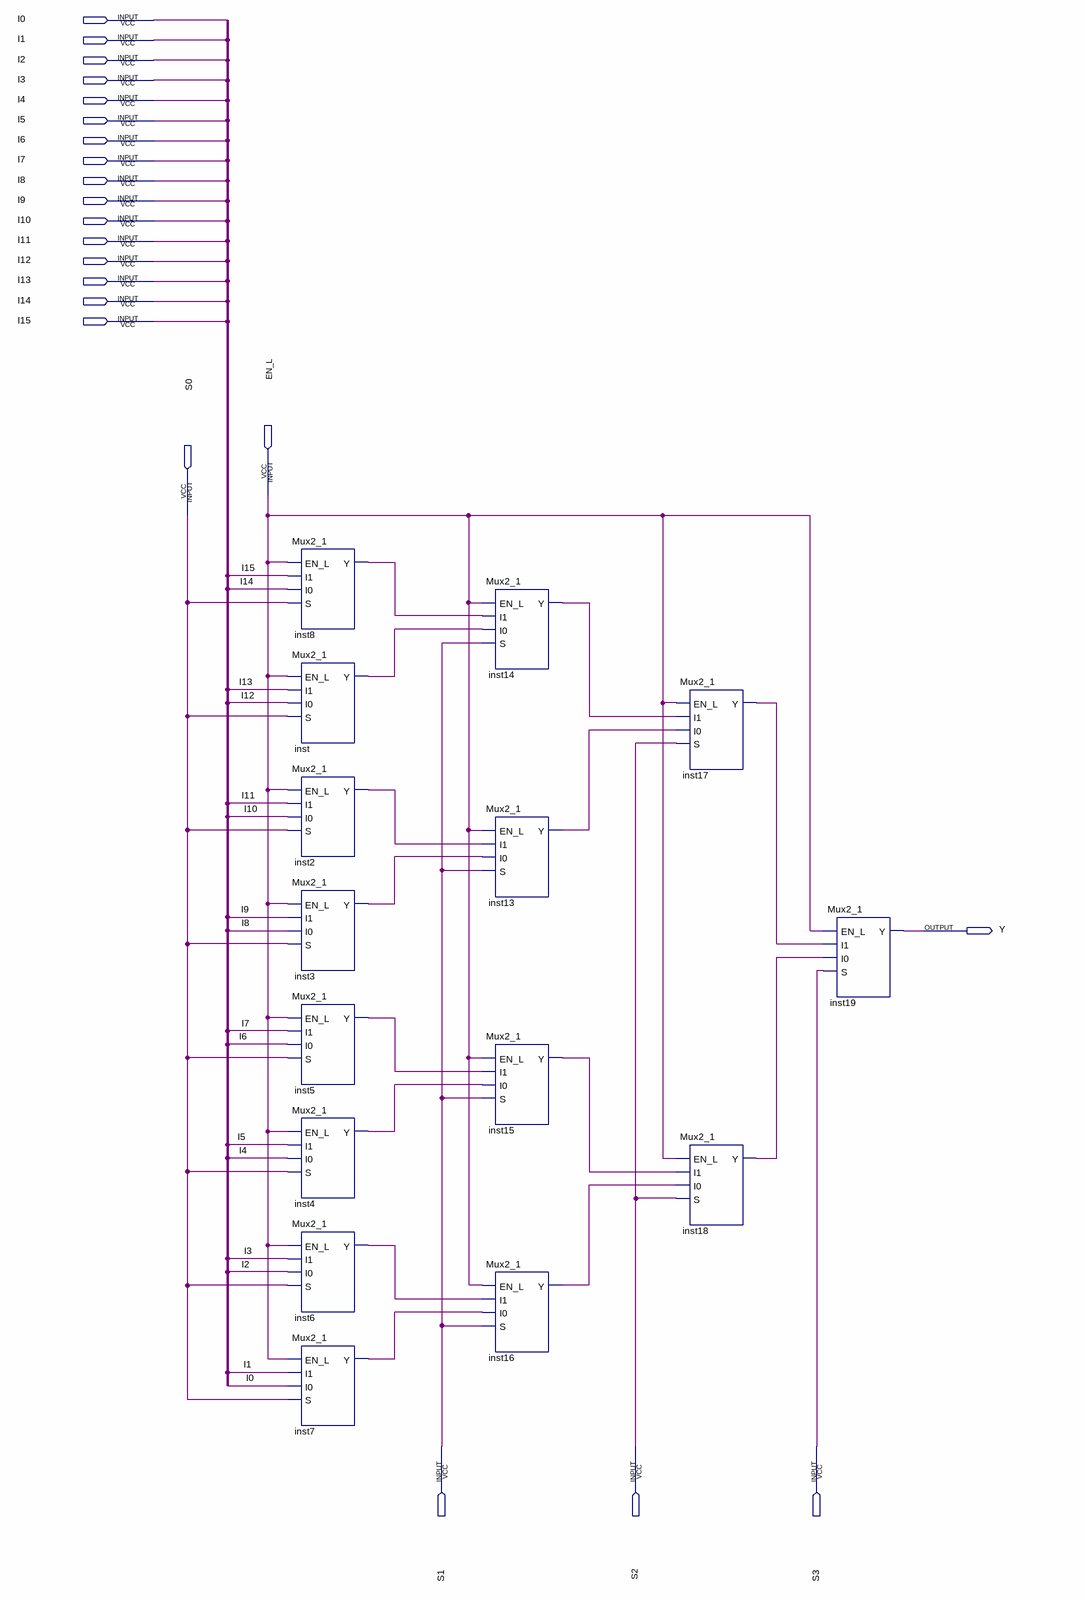
[diagram p0: schematic sheet]
// Quartus schematic Mux16_1.bdf as structural Verilog: 15 symbols, 22 pins
module Mux16_1 (
  input  I0,
  input  I1,
  input  I2,
  input  I3,
  input  I4,
  input  I5,
  input  I6,
  input  I7,
  input  I8,
  input  I9,
  input  I10,
  input  I11,
  input  I12,
  input  I13,
  input  I14,
  input  I15,
  input  EN_L,
  input  S0,
  input  S1,
  input  S2,
  input  S3,
  output Y
);

  wire inst2_y, inst3_y, inst4_y, inst5_y, inst6_y, inst7_y, inst8_y, inst13_y, inst14_y, inst15_y, inst16_y,
       inst17_y, inst18_y, inst_y;

  Mux2_1 inst8 (.EN_L(EN_L), .I1(I15), .I0(I14), .S(S0), .Y(inst8_y));
  Mux2_1 inst (.EN_L(EN_L), .I1(I13), .I0(I12), .S(S0), .Y(inst_y));
  Mux2_1 inst2 (.EN_L(EN_L), .I1(I11), .I0(I10), .S(S0), .Y(inst2_y));
  Mux2_1 inst3 (.EN_L(EN_L), .I1(I9), .I0(I8), .S(S0), .Y(inst3_y));
  Mux2_1 inst5 (.EN_L(EN_L), .I1(I7), .I0(I6), .S(S0), .Y(inst5_y));
  Mux2_1 inst4 (.EN_L(EN_L), .I1(I5), .I0(I4), .S(S0), .Y(inst4_y));
  Mux2_1 inst6 (.EN_L(EN_L), .I1(I3), .I0(I2), .S(S0), .Y(inst6_y));
  Mux2_1 inst7 (.EN_L(EN_L), .I1(I1), .I0(I0), .S(S0), .Y(inst7_y));
  Mux2_1 inst14 (.EN_L(EN_L), .I1(inst8_y), .I0(inst_y), .S(S1), .Y(inst14_y));
  Mux2_1 inst13 (.EN_L(EN_L), .I1(inst2_y), .I0(inst3_y), .S(S1), .Y(inst13_y));
  Mux2_1 inst15 (.EN_L(EN_L), .I1(inst5_y), .I0(inst4_y), .S(S1), .Y(inst15_y));
  Mux2_1 inst16 (.EN_L(EN_L), .I1(inst6_y), .I0(inst7_y), .S(S1), .Y(inst16_y));
  Mux2_1 inst17 (.EN_L(EN_L), .I1(inst14_y), .I0(inst13_y), .S(S2), .Y(inst17_y));
  Mux2_1 inst18 (.EN_L(EN_L), .I1(inst15_y), .I0(inst16_y), .S(S2), .Y(inst18_y));
  Mux2_1 inst19 (.EN_L(EN_L), .I1(inst17_y), .I0(inst18_y), .S(S3), .Y(Y));
endmodule
